# EasyEDA schematic RGB-Controller.json
TITLE: 12v RGB WiFi Controller; REV: 0.4; Date: 2022-04-02; Sheet: 1/1; Drawn By: Sneer; Company: Zarus Labs
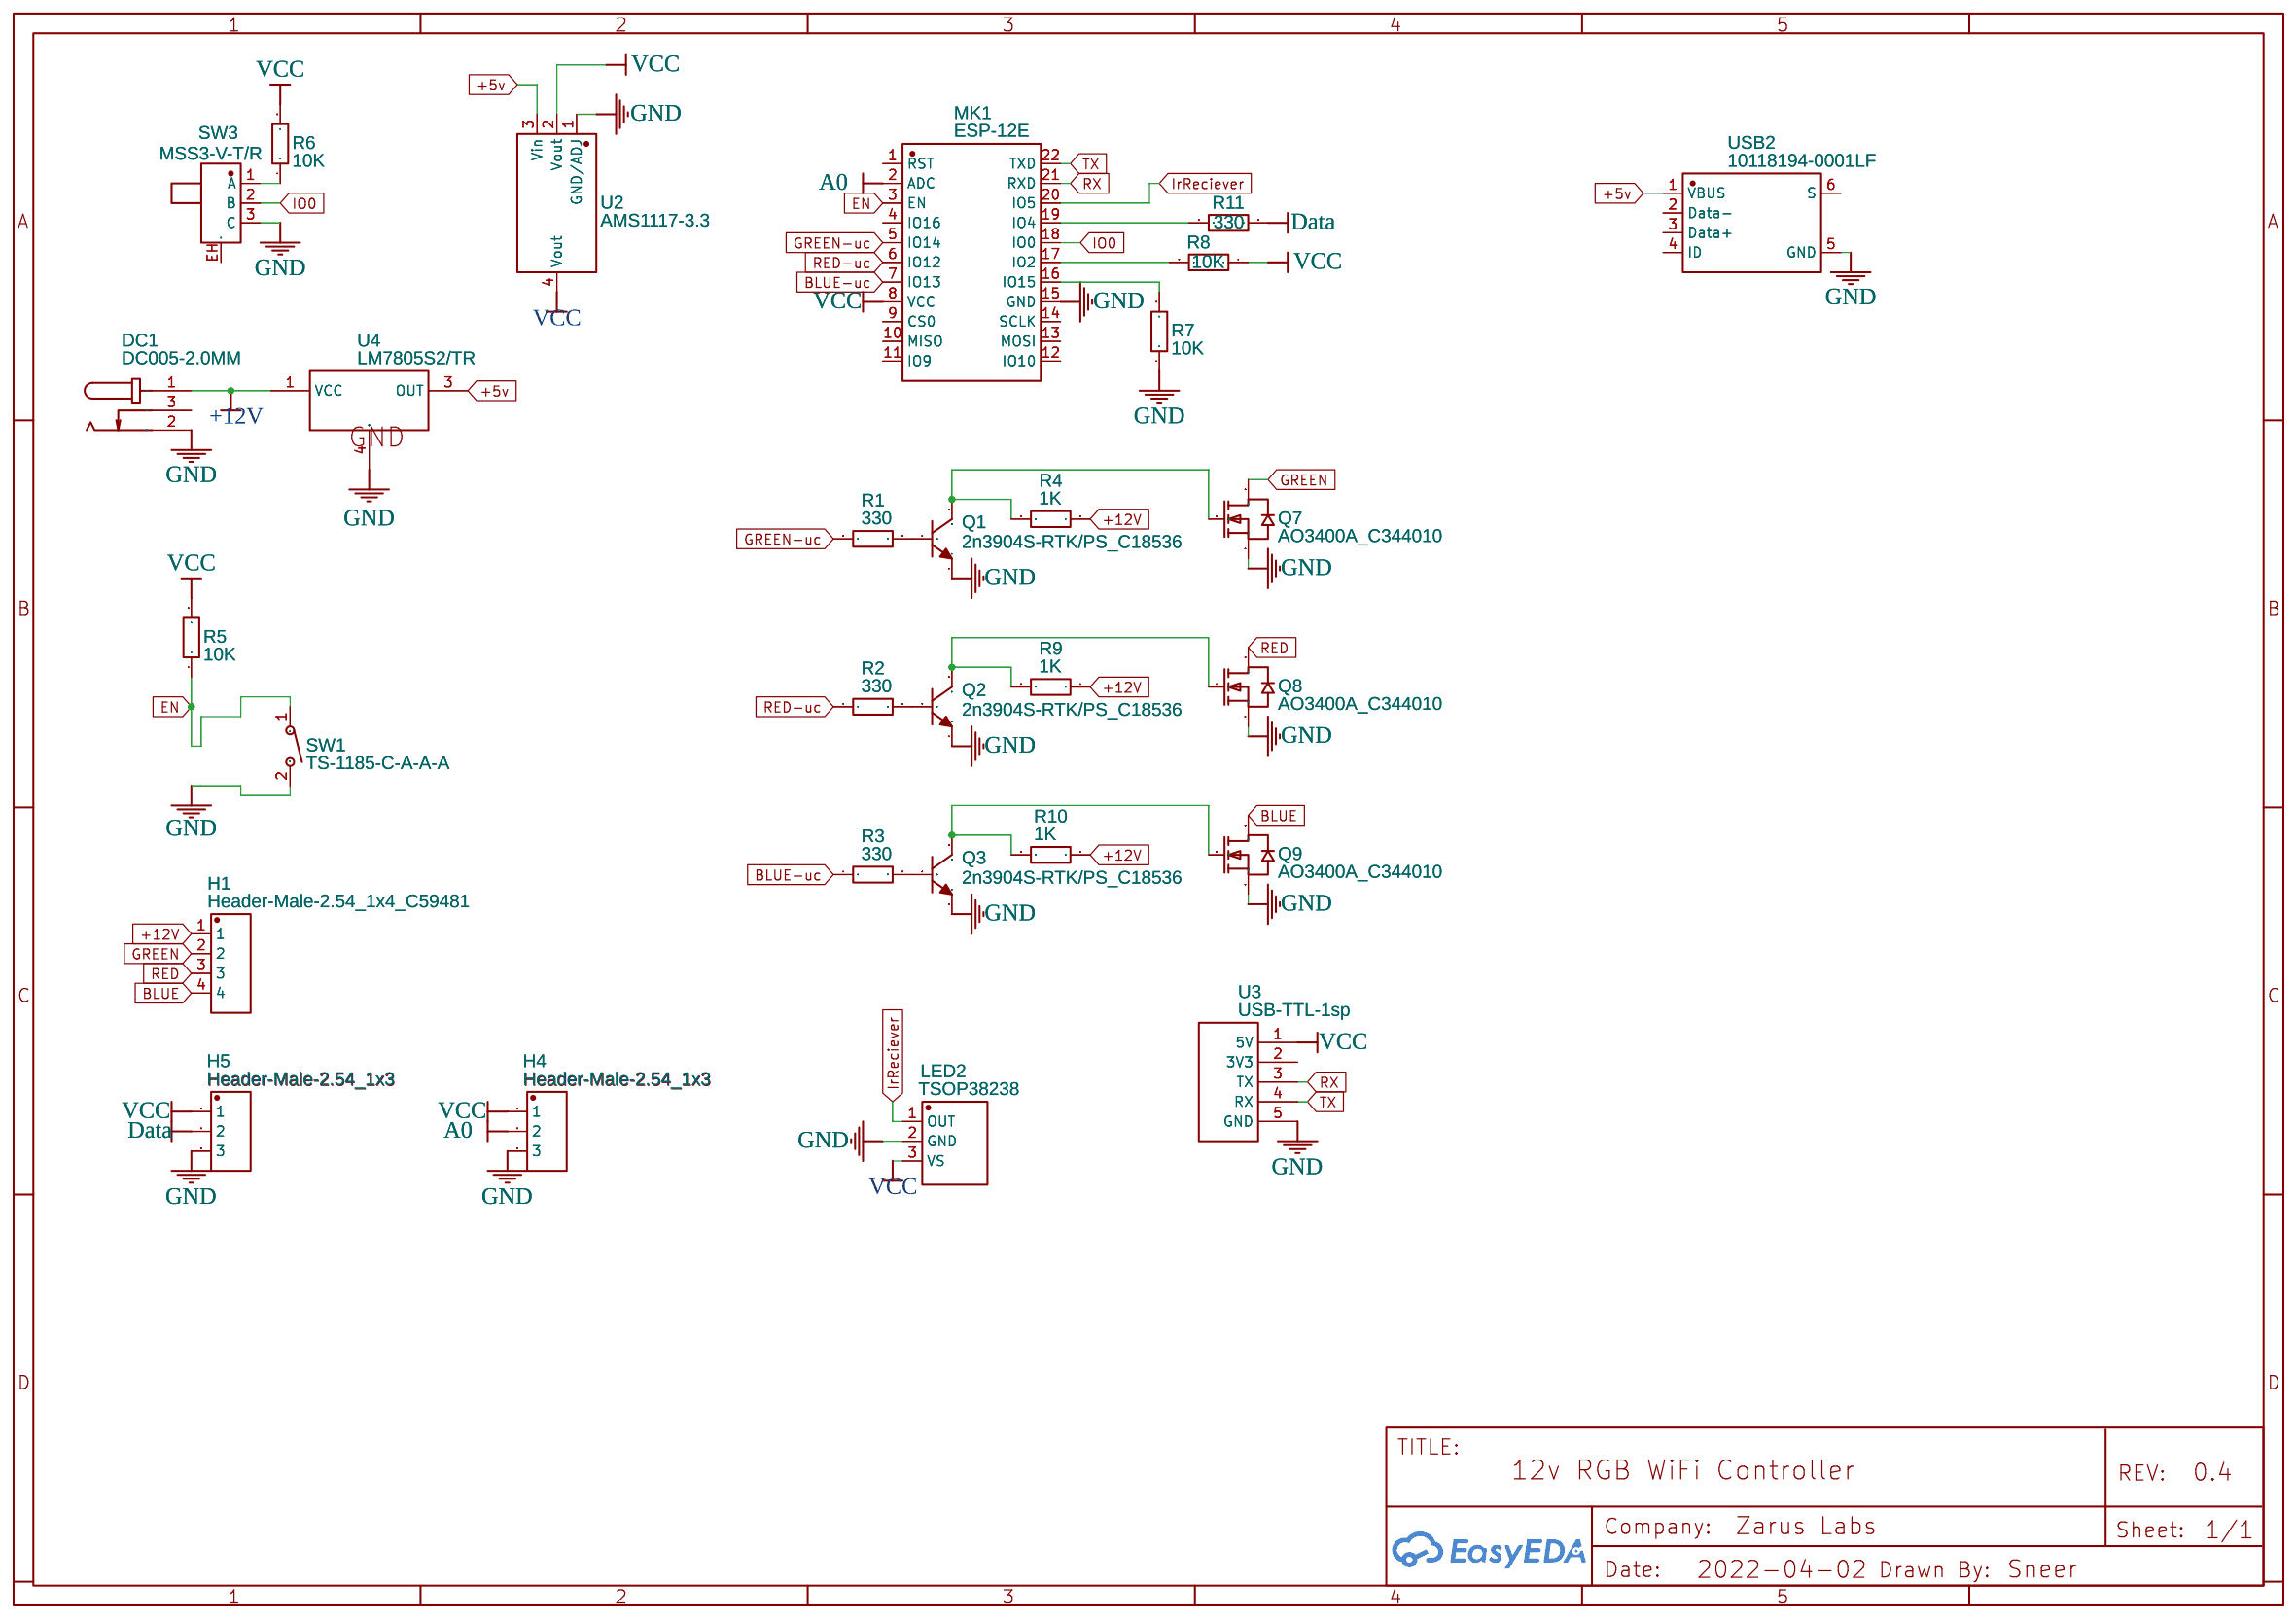
[diagram p0: schematic sheet]

## Parts
DC1  DC005-2.0MM  [DC-IN-TH_DC005]
H1  Header-Male-2.54_1x4_C59481  [HDR-TH_4P-P2.54-V]
H4  Header-Male-2.54_1x3  [HEADER-MALE-2.54_1X3]
H5  Header-Male-2.54_1x3  [HEADER-MALE-2.54_1X3]
LED2  TSOP38238  [SENSOR-TG_TSOP38236]
MK1  ESP-12E  [WIFIM-SMD_ESP-12E]
Q1  2n3904S-RTK/PS_C18536  [SOT-23-3_L2.9-W1.3-P1.90-LS2.4-TR]
Q2  2n3904S-RTK/PS_C18536  [SOT-23-3_L2.9-W1.3-P1.90-LS2.4-TR]
Q3  2n3904S-RTK/PS_C18536  [SOT-23-3_L2.9-W1.3-P1.90-LS2.4-TR]
Q7  AO3400A_C344010  [SOT-23_L2.9-W1.3-P1.90-LS2.4-BR]
Q8  AO3400A_C344010  [SOT-23_L2.9-W1.3-P1.90-LS2.4-BR]
Q9  AO3400A_C344010  [SOT-23_L2.9-W1.3-P1.90-LS2.4-BR]
R1  330  [R0805]
R2  330  [R0805]
R3  330  [R0805]
R4  1K  [R1210]
R5  10K  [R1206]
R6  10K  [R1206]
R7  10K  [R1206]
R8  10K  [R1206]
R9  1K  [R1210]
R10  1K  [R1210]
R11  330  [R0805]
SW1  TS-1185-C-A-A-A  [SW-SMD_L4.0-W3.0-LS5.0-EH]
SW3  MSS3-V-T/R  [SW-SMD_MSS3-V-T-R]
U2  AMS1117-3.3  [SOT-223-3_L6.5-W3.4-P2.30-LS7.0-BR]
U3  USB-TTL-1sp  [USB-TTL]
U4  LM7805S2/TR  [TO-263-2_L10.0-W9.1-P5.08-LS15.2-BL]
USB2  10118194-0001LF  [MICRO-USB-SMD_10118194-0001LF]

## Library data of the parts
DC1 = DC005-2.0MM: Supplier: LCSC; Manufacturer: SOFNG; Supplier Part: C111567
H1 = Header-Male-2.54_1x4_C59481: Supplier: LCSC; Manufacturer: ReliaPro; Manufacturer Part: Headers  Pins 1*4P; Supplier Part: C59481; Package Display: No
H4 H5 = Header-Male-2.54_1x3: Contributor: Destiny
LED2 = TSOP38238: Supplier: LCSC; Manufacturer: VISHAY; Contributor: LCSC; Supplier Part: C141632; JLCPCB Part Class: Extended Part
MK1 = ESP-12E: Supplier: LCSC; Manufacturer: Ai-Thinker; Supplier Part: C89297; JLCPCB Part Class: Extended Part
Q1-Q3 = 2n3904S-RTK/PS_C18536: Supplier: LCSC; Manufacturer: KEC; Manufacturer Part: 2n3904S-RTK/PS; Supplier Part: C18536; JLCPCB Part Class: Extended Part
Q7-Q9 = AO3400A_C344010: Supplier: LCSC; Supplier Part: C344010; Manufacturer: Bourne Semicon (Shenzhen); Manufacturer Part: AO3400A; Contributor: LCSC; JLCPCB Part Class: Extended Part
R1-R3 R11 = 0805W8J0331T5E: Supplier: LCSC; Manufacturer: UniOhm; Supplier Part: C25306; JLCPCB Part Class: Extended Part
R4 R9 R10 = 1210W3J0102T5E: Supplier: LCSC; Manufacturer: UniOhm; Supplier Part: C25681; JLCPCB Part Class: Extended Part
R5-R8 = 1206W4F1002T5E: Supplier: LCSC; Manufacturer: UniOhm; Supplier Part: C17902; JLCPCB Part Class: Basic Part
SW1 = TS-1185-C-A-A-A: Supplier: LCSC; Supplier Part: C561518; Manufacturer: XKB Enterprise; Contributor: LCSC; JLCPCB Part Class: Extended Part
SW3 = MSS3-V-T/R: Supplier: LCSC; Supplier Part: C495932; Manufacturer: Diptronics; Contributor: LCSC; JLCPCB Part Class: Extended Part
U2 = AMS1117-3.3: sourceId: dwIGgezVh; Supplier: LCSC; Manufacturer: AMS; Supplier Part: C6186; JLCPCB Part Class: Basic Part
U3 = USB-TTL-1sp: Contributor: ask015
U4 = LM7805S2/TR: Supplier: LCSC; Supplier Part: C2902505; Manufacturer: HGSEMI(华冠); Contributor: LCSC; JLCPCB Part Class: Extended Part
USB2 = 10118194-0001LF: Supplier: LCSC; Supplier Part: C132563; Manufacturer: Amphenol ICC; Contributor: LCSC; JLCPCB Part Class: Extended Part

## Nets
+5v: U2.3(Vin) U4.3(OUT) USB2.1(VBUS)
+12V: DC1.1 H1.1 R4.1 R9.1 R10.1 U4.1(VCC)
GND: DC1.2 H4.3 H5.3 LED2.2(GND) MK1.15(GND) Q1.1(E) Q2.1(E) Q3.1(E) Q7.2(S) Q8.2(S) Q9.2(S) R7.1 SW1.2 SW3.3(C) U2.1(GND/ADJ) U3.5(GND) U4.4(GND) USB2.5(GND)
VCC: H4.1 H5.1 LED2.3(VS) MK1.8(VCC) R5.2 R6.2 R8.1 U2.2(Vout) U2.4(Vout) U3.1(5V)
A0: H4.2 MK1.2(ADC)
BLUE: H1.4 Q9.3(D)
BLUE-uc: MK1.7(IO13) R3.1
Data: H5.2 R11.2
EN: MK1.3(EN) R5.1 SW1.1
GREEN: H1.2 Q7.3(D)
GREEN-uc: MK1.5(IO14) R1.1
IO0: MK1.18(IO0) SW3.2(B)
IrReciever: LED2.1(OUT) MK1.20(IO5)
RED: H1.3 Q8.3(D)
RED-uc: MK1.6(IO12) R2.1
RX: MK1.21(RXD) U3.3(TX)
TX: MK1.22(TXD) U3.4(RX)
Net-(MK1-16): MK1.16(IO15) R7.2
Net-(MK1-17): MK1.17(IO2) R8.2
Net-(MK1-19): MK1.19(IO4) R11.1
Net-(Q1-2): Q1.2(B) R1.2
Net-(Q1-3): Q1.3(C) Q7.1(G) R4.2
Net-(Q2-2): Q2.2(B) R2.2
Net-(Q2-3): Q2.3(C) Q8.1(G) R9.2
Net-(Q3-2): Q3.2(B) R3.2
Net-(Q3-3): Q3.3(C) Q9.1(G) R10.2
Net-(R6-1): R6.1 SW3.1(A)

Not connected (* = marked no-connect by the designer): DC1 3; MK1 1(RST) 4(IO16) 9(CS0) 10(MISO) 11(IO9) 12(IO10) 13(MOSI) 14(SCLK); SW3 EH; U3 2(3V3); USB2 2(Data-) 3(Data+) 4(ID) 6(S)
